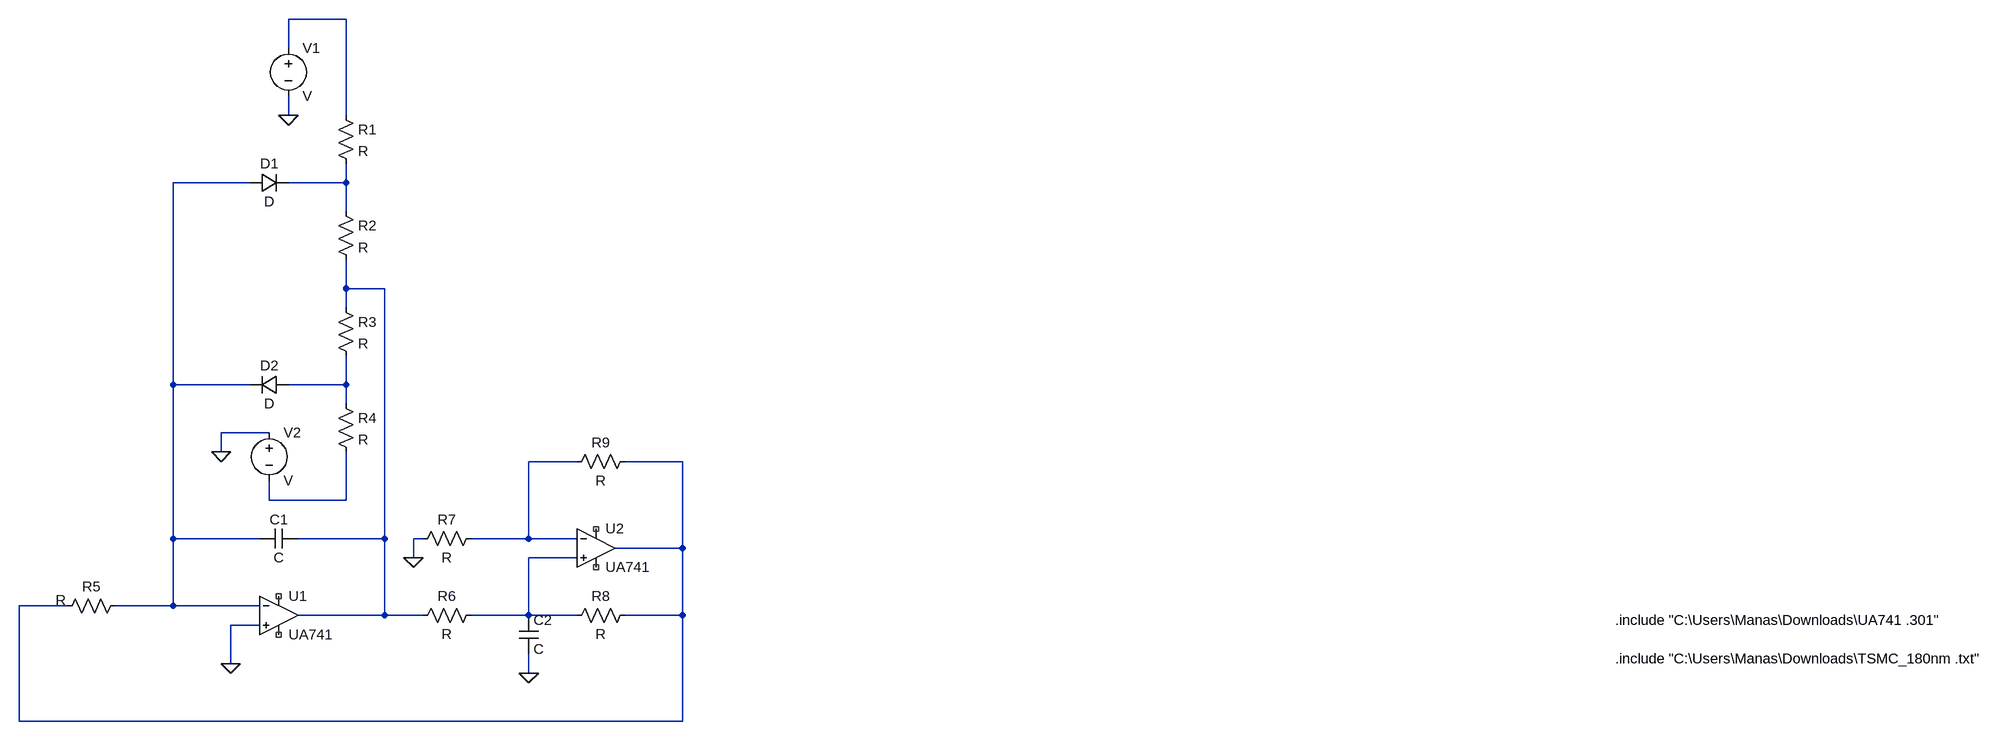
[diagram p0: schematic quadrature oscillator.asc]
quadrature oscillator.asc, the LTspice schematic file:
Version 4
SHEET 1 2820 1012
WIRE 0 -160 -96 -160
WIRE -96 -112 -96 -160
WIRE -96 0 -96 -32
WIRE 0 0 0 -160
WIRE -160 112 -288 112
WIRE 0 112 0 80
WIRE 0 112 -96 112
WIRE 0 160 0 112
WIRE 0 288 0 240
WIRE 64 288 0 288
WIRE 0 320 0 288
WIRE -288 448 -288 112
WIRE -160 448 -288 448
WIRE 0 448 0 400
WIRE 0 448 -96 448
WIRE 0 480 0 448
WIRE -128 528 -208 528
WIRE -208 560 -208 528
WIRE 384 576 304 576
WIRE 560 576 464 576
WIRE -128 640 -128 608
WIRE 0 640 0 560
WIRE 0 640 -128 640
WIRE -288 704 -288 448
WIRE -144 704 -288 704
WIRE 64 704 64 288
WIRE 64 704 -80 704
WIRE 128 704 112 704
WIRE 304 704 304 576
WIRE 304 704 208 704
WIRE 384 704 304 704
WIRE 560 720 560 576
WIRE 560 720 448 720
WIRE 112 736 112 704
WIRE 384 736 304 736
WIRE -464 816 -544 816
WIRE -288 816 -288 704
WIRE -288 816 -384 816
WIRE -144 816 -288 816
WIRE 64 832 64 704
WIRE 64 832 -80 832
WIRE 128 832 64 832
WIRE 304 832 304 736
WIRE 304 832 208 832
WIRE 384 832 304 832
WIRE 560 832 560 720
WIRE 560 832 464 832
WIRE -144 848 -192 848
WIRE -192 912 -192 848
WIRE 304 928 304 896
WIRE -544 1008 -544 816
WIRE 560 1008 560 832
WIRE 560 1008 -544 1008
FLAG -192 912 0
FLAG 304 928 0
FLAG 112 736 0
FLAG -96 0 0
FLAG -208 560 0
SYMBOL res -16 -16 R0
SYMATTR InstName R1
SYMBOL res -16 144 R0
SYMATTR InstName R2
SYMBOL res -16 304 R0
SYMATTR InstName R3
SYMBOL res -16 464 R0
SYMATTR InstName R4
SYMBOL cap -80 688 R90
WINDOW 0 0 32 VBottom 2
WINDOW 3 32 32 VTop 2
SYMATTR InstName C1
SYMBOL res -368 800 R90
WINDOW 0 0 56 VBottom 2
WINDOW 3 -9 107 VTop 2
SYMATTR InstName R5
SYMBOL OpAmps\\opamp2 -112 768 R0
SYMATTR InstName U1
SYMATTR Value UA741
SYMBOL OpAmps\\opamp2 416 656 R0
SYMATTR InstName U2
SYMATTR Value UA741
SYMBOL res 224 816 R90
WINDOW 0 0 56 VBottom 2
WINDOW 3 32 56 VTop 2
SYMATTR InstName R6
SYMBOL res 224 688 R90
WINDOW 0 0 56 VBottom 2
WINDOW 3 32 56 VTop 2
SYMATTR InstName R7
SYMBOL cap 288 832 R0
SYMATTR InstName C2
SYMBOL res 480 816 R90
WINDOW 0 0 56 VBottom 2
WINDOW 3 32 56 VTop 2
SYMATTR InstName R8
SYMBOL res 480 560 R90
WINDOW 0 0 56 VBottom 2
WINDOW 3 32 56 VTop 2
SYMATTR InstName R9
SYMBOL voltage -96 -128 R0
SYMATTR InstName V1
SYMBOL voltage -128 512 R0
SYMATTR InstName V2
SYMBOL diode -160 128 R270
WINDOW 0 32 32 VTop 2
WINDOW 3 0 32 VBottom 2
SYMATTR InstName D1
SYMBOL diode -96 432 R90
WINDOW 0 0 32 VBottom 2
WINDOW 3 32 32 VTop 2
SYMATTR InstName D2
TEXT 2112 904 Left 2 !.include "C:\\Users\\Manas\\Downloads\\TSMC_180nm .txt"
TEXT 2112 840 Left 2 !.include "C:\\Users\\Manas\\Downloads\\UA741 .301"

The netlist it stands for:
* quadrature oscillator.asc
R1 N001 N003 R
R2 N003 N004 R
R3 N004 N005 R
R4 N005 N008 R
C1 N004 N002 C
R5 N002 N007 R
XU1 0 N002 NC_01 NC_02 N004 UA741  ; pins In+ In- V+ V- OUT
XU2 N009 N006 NC_03 NC_04 N007 UA741  ; pins In+ In- V+ V- OUT
R6 N009 N004 R
R7 N006 0 R
C2 N009 0 C
R8 N007 N009 R
R9 N007 N006 R
V1 N001 0 V
V2 0 N008 V
D1 N002 N003 D
D2 N005 N002 D
.model D D
.lib standard.dio
.include "C:\Users\Manas\Downloads\TSMC_180nm .txt"
.include "C:\Users\Manas\Downloads\UA741 .301"
.backanno
.end